# EAGLE design cBlocks proto shield (EAGLE 9.1.3)
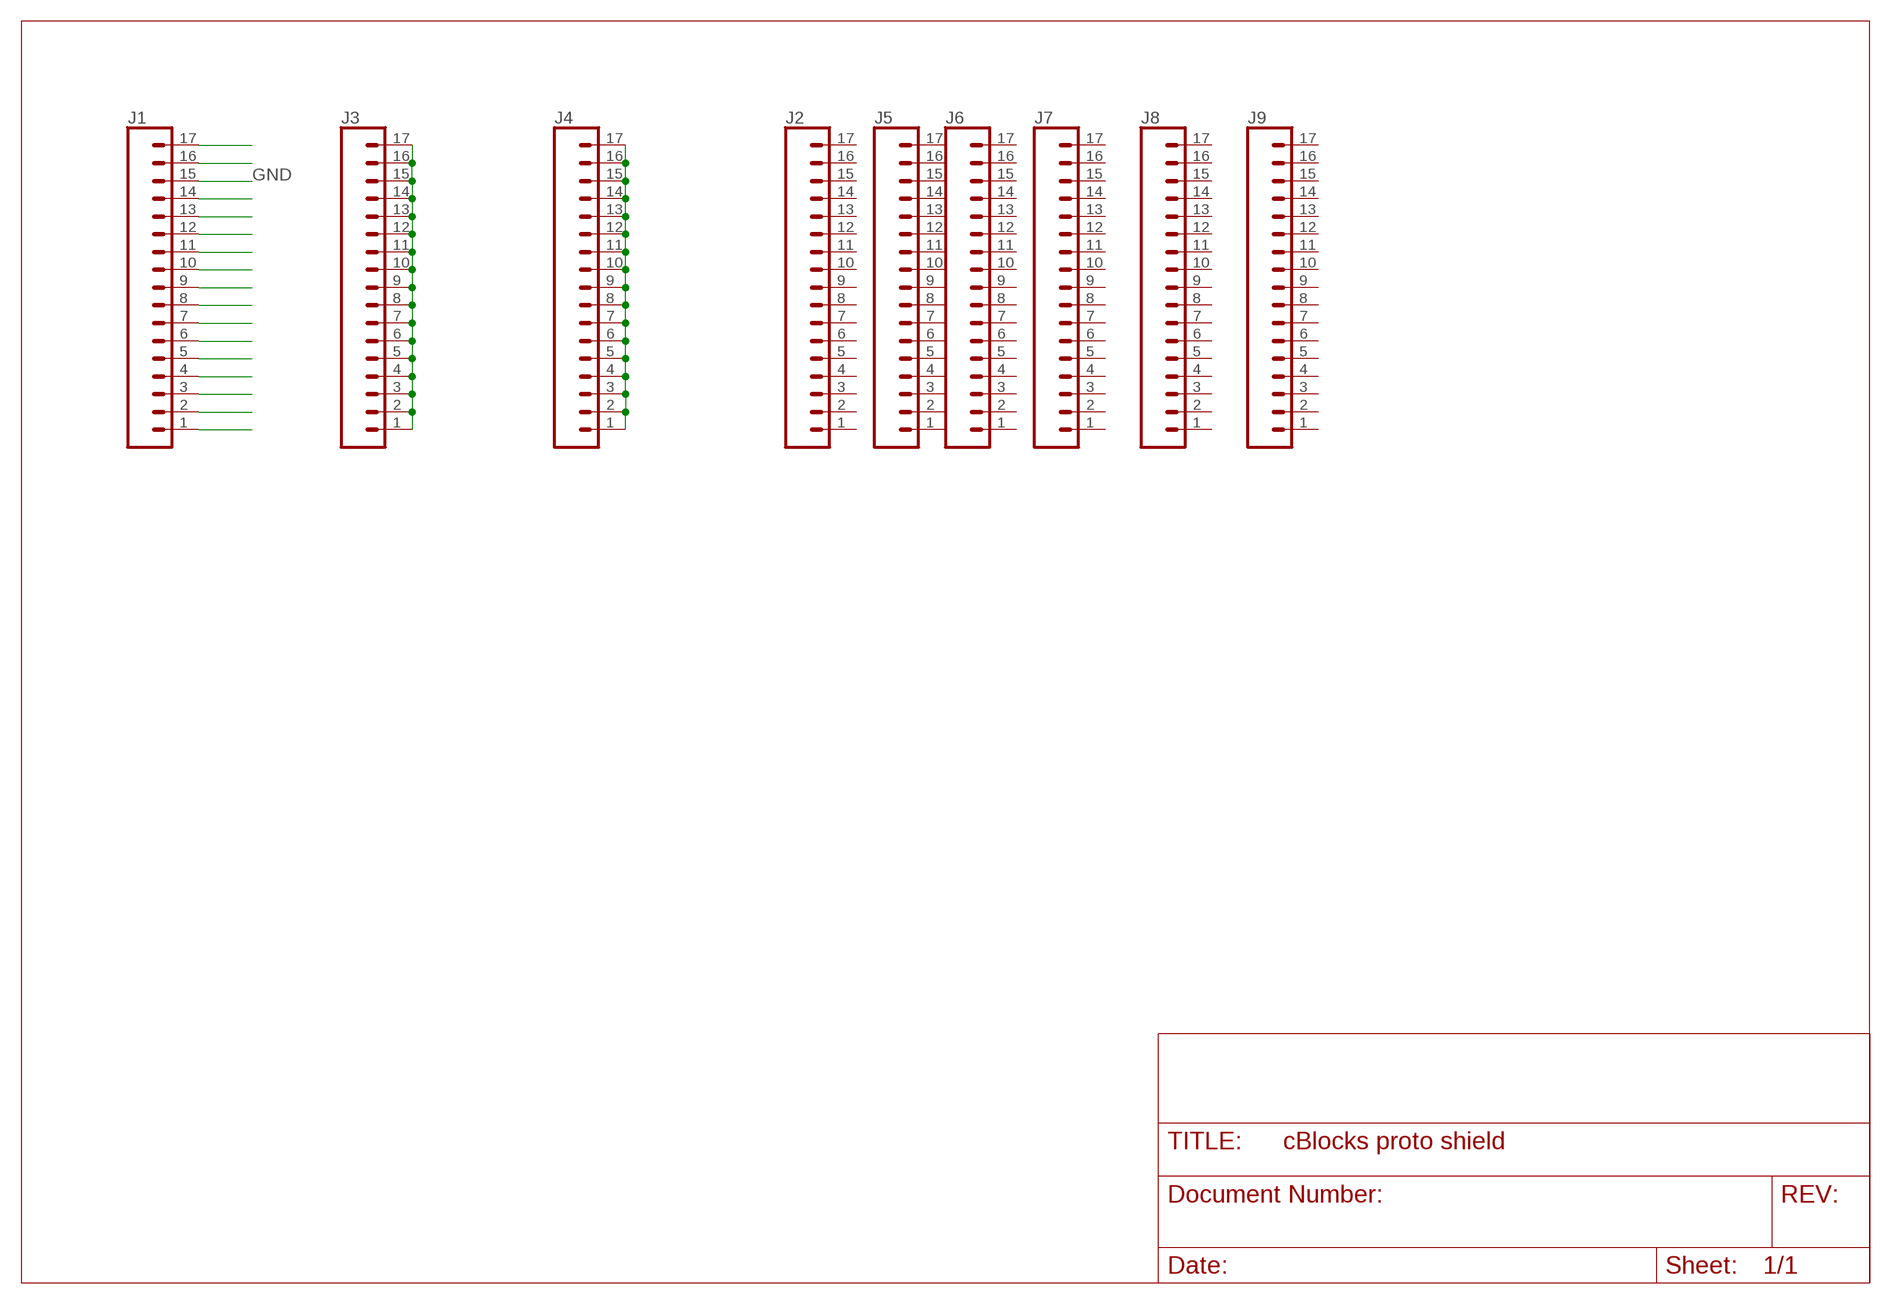
[diagram p0: schematic, sheet 1]

## Parts
J1  CONN_17NOSILK  [1X17_NO_SILK]
J2  CONN_17NOSILK  [1X17_NO_SILK]
J3  CONN_17NOSILK  [1X17_NO_SILK]
J4  CONN_17NOSILK  [1X17_NO_SILK]
J5  CONN_17NOSILK  [1X17_NO_SILK]
J6  CONN_17NOSILK  [1X17_NO_SILK]
J7  CONN_17NOSILK  [1X17_NO_SILK]
J8  CONN_17NOSILK  [1X17_NO_SILK]
J9  CONN_17NOSILK  [1X17_NO_SILK]

## Nets
GND: J1.15
N$1: J3.1 J3.2 J3.3 J3.4 J3.5 J3.6 J3.7 J3.8 J3.9 J3.10 J3.11 J3.12 J3.13 J3.14 J3.15 J3.16 J3.17
N$2: J1.2
N$3: J1.3
N$4: J1.4
N$5: J1.5
N$6: J1.6
N$7: J1.7
N$8: J1.8
N$9: J1.9
N$10: J1.10
N$11: J1.11
N$12: J1.12
N$13: J1.13
N$14: J1.14
N$16: J1.16
N$17: J1.17
N$18: J4.1 J4.2 J4.3 J4.4 J4.5 J4.6 J4.7 J4.8 J4.9 J4.10 J4.11 J4.12 J4.13 J4.14 J4.15 J4.16 J4.17
TEST: J1.1
Unconnected: J2.1 J2.2 J2.3 J2.4 J2.5 J2.6 J2.7 J2.8 J2.9 J2.10 J2.11 J2.12 J2.13 J2.14 J2.15 J2.16 J2.17 J5.1 J5.2 J5.3 J5.4 J5.5 J5.6 J5.7 J5.8 J5.9 J5.10 J5.11 J5.12 J5.13 J5.14 J5.15 J5.16 J5.17 J6.1 J6.2 J6.3 J6.4 J6.5 J6.6 J6.7 J6.8 J6.9 J6.10 J6.11 J6.12 J6.13 J6.14 J6.15 J6.16 J6.17 J7.1 J7.2 J7.3 J7.4 J7.5 J7.6 J7.7 J7.8 J7.9 J7.10 J7.11 J7.12 J7.13 J7.14 J7.15 J7.16 J7.17 J8.1 J8.2 J8.3 J8.4 J8.5 J8.6 J8.7 J8.8 J8.9 J8.10 J8.11 J8.12 J8.13 J8.14 J8.15 J8.16 J8.17 J9.1 J9.2 J9.3 J9.4 J9.5 J9.6 J9.7 J9.8 J9.9 J9.10 J9.11 J9.12 J9.13 J9.14 J9.15 J9.16 J9.17

## Library data of the parts
J1-J9 = SparkFun-Connectors:CONN_17: Multi connection point. Often used as Generic Header-pin footprint for 0.1 inch spaced/style header connections On any of the 0.1 inch spaced packages, you can populate with these: Break Away Headers - Straight <https://www.sparkfun.com/products/116> (PRT-00116) Break Away Male Headers - Right Angle <https://www.sparkfun.com/products/553> (PRT-00553) Female Headers <https://www.sparkfun.com/products/115> (PRT-00115) Break Away Headers - Machine Pin <https://www.sparkfun.com/products/117> (PRT-00117) Break Away Female Headers - Swiss Machine Pin <https://www.sparkfun.com/products/743> (PRT-00743) For SCREWTERMINALS and SPRING TERMINALS visit here: Screw Terimnals on SparkFun.com <https://www.sparkfun.com/search/results?term=Screw+Terminals> (5mm/3.5mm/2.54mm spacing) This device is also useful as a general connection point to wire up your design to another part of your project. Our various solder wires solder well into these plated through hole pads. Hook-Up Wire - Assortment (Stranded, 22 AWG) <https://www.sparkfun.com/products/11375> (PRT-11375) Hook-Up Wire - Assortment (Solid Core, 22 AWG) <https://www.sparkfun.com/products/11367> (PRT-11367) View the entire wire category on our website here <https://www.sparkfun.com/categories/141> Special notes: Molex polarized connector foot print use with SKU : PRT-08231 with associated crimp pins and housings. 1MM SMD Version SKU: PRT-10208 NOTES ON THE VARIANTS LOCK and LOCK_LONGPADS... This footprint was designed to help hold the alignment of a through-hole component (i.e. 6-pin header) while soldering it into place. You may notice that each hole has been shifted either up or down by 0.005 of an inch from it's more standard position (which is a perfectly straight line). This slight alteration caused the pins (the squares in the middle) to touch the edges of the holes. Because they are alternating, it causes a "brace" to hold the component in place. 0.005 has proven to be the perfect amount of "off-center" position when using our standard breakaway headers. Although looks a little odd when you look at the bare footprint, once you have a header in there, the alteration is very hard to notice. Also,if you push a header all the way into place, it is covered up entirely on the bottom side.

## Board
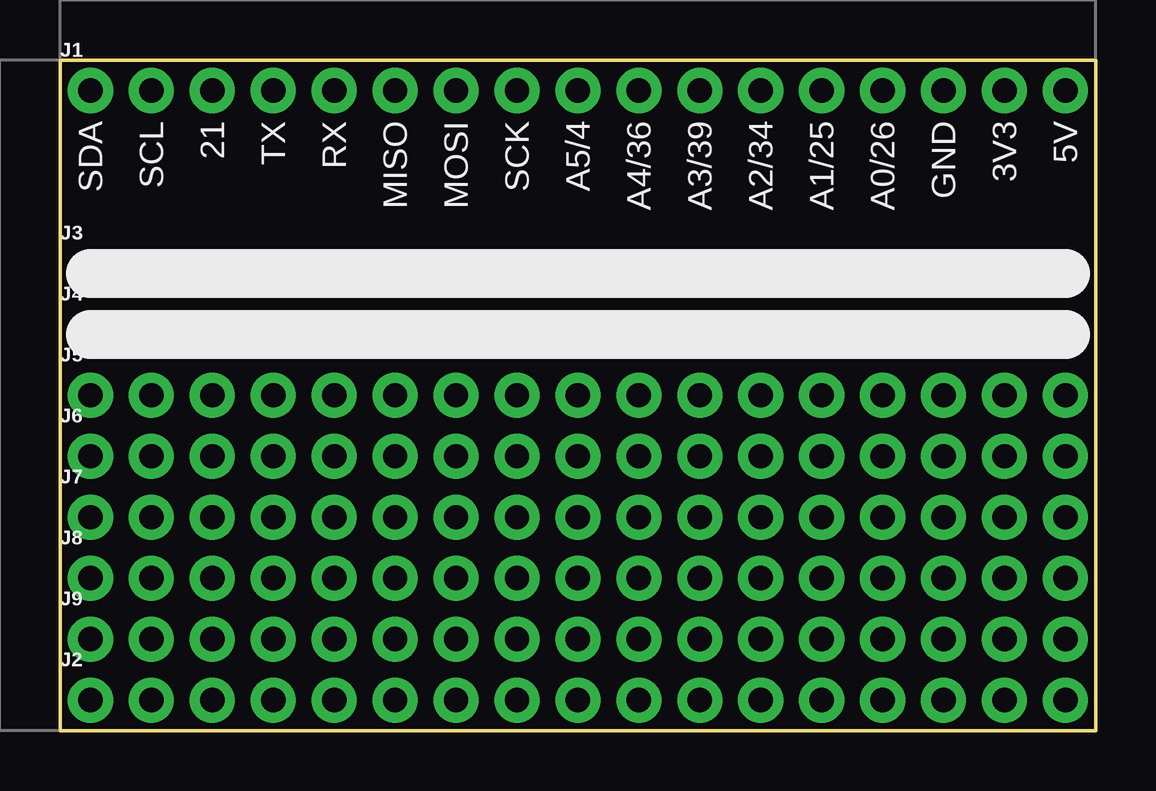
[diagram p1: board, top side]
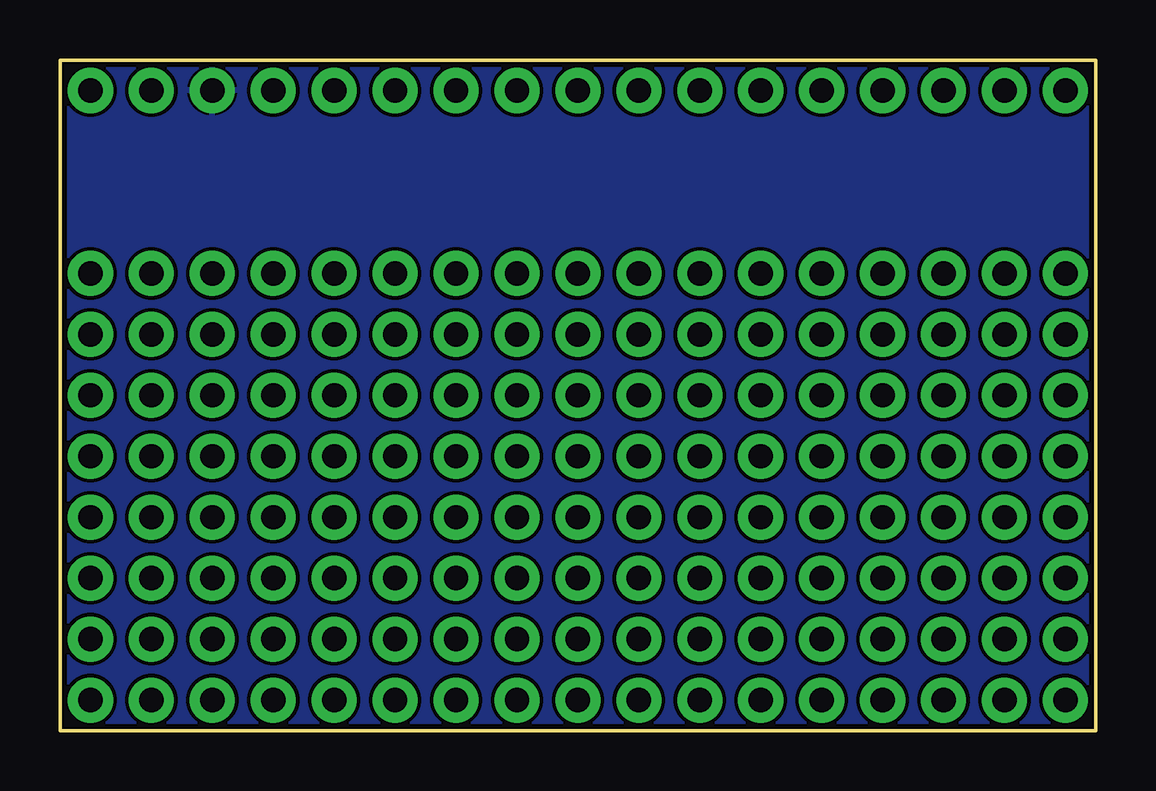
[diagram p2: board, bottom side, seen from below]

Size 43.18 x 27.94 mm. Coordinates in mm from the lower left corner, seen from the top.
Outline: 0,27.94 43.18,27.94 43.18,0 0,0 0,27.94
Copper layers (1*16): Top 0.018mm / dielectric 1.55mm / Bottom 0.018mm
Design rules "Fischer_zweilagig": minimum track width 0.15mm, minimum drill 0.3mm, track to track 0.15mm, track to pad 0.15mm, pad to pad 0.15mm, via to via 0.15mm, smd to smd 0mil, copper to edge 0.2mm, drill to drill 0.2mm, minimum pad ring 0.15mm, minimum via ring 0.15mm, stop-mask expansion 2mil, vias tented up to drill 0.45mm, thermal gap 0.1mm

### Footprints (pad centres in the part's own frame; a part is rotated, then mirrored left to right if it is on the bottom)
1X17_NO_SILK = drill 1.016 pad 1.88: 1 0,0; 2 2.54,0; 3 5.08,0; 4 7.62,0; 5 10.16,0; 6 12.7,0; 7 15.24,0; 8 17.78,0; 9 20.32,0; 10 22.86,0; 11 25.4,0; 12 27.94,0; 13 30.48,0; 14 33.02,0; 15 35.56,0; 16 38.1,0; 17 40.64,0

### Placement (x,y rotation side)
J1  1.27,26.67 0 top
J2  1.27,1.27 0 top
J3  1.27,19.05 0 top
J4  1.27,16.51 0 top
J5  1.27,13.97 0 top
J6  1.27,11.43 0 top
J7  1.27,8.89 0 top
J8  1.27,6.35 0 top
J9  1.27,3.81 0 top

### Tracks (layer width: path | path; a pad name or v marks a point on that pad's centre or on a via)
GND
  pour Bottom: 0,27.94 0,0 43.18,0 43.18,27.94
N$1
  Top 0.15: J3.17 41.85,19.04 39.45,19.04 J3.16 39.3,19.04 36.9,19.04 J3.15 36.75,19.04 34.35,19.04 J3.14 34.2,19.04 31.8,19.04 J3.13 31.65,19.04 29.25,19.04 J3.12 29.1,19.04 26.7,19.04 J3.11 26.55,19.04 24.15,19.04 J3.10 24,19.04 J3.9 21.45,19.04 J3.8 | J3.1 1.35,19.04 3.75,19.04 J3.2 3.9,19.04 6.3,19.04 J3.3 6.45,19.04 8.85,19.04 J3.4 9,19.04 11.4,19.04 J3.5 11.55,19.04 13.95,19.04 J3.6 14.1,19.04 J3.7 16.65,19.04 J3.8 | J3.8
N$18
  Top 0.15: J4.17 41.85,16.49 39.45,16.49 J4.16 39.3,16.49 36.9,16.49 J4.15 36.75,16.49 34.35,16.49 J4.14 34.2,16.49 31.8,16.49 J4.13 31.65,16.49 29.25,16.49 J4.12 29.1,16.49 26.7,16.49 J4.11 26.55,16.49 24.15,16.49 J4.10 24,16.49 21.6,16.49 J4.9 21.45,16.49 19.05,16.49 | J4.1 1.35,16.49 3.75,16.49 J4.2 3.9,16.49 6.3,16.49 J4.3 6.45,16.49 8.85,16.49 J4.4 9,16.49 11.4,16.49 J4.5 11.55,16.49 13.95,16.49 J4.6 14.1,16.49 16.5,16.49 J4.7 16.65,16.49 19.05,16.49 | 19.05,16.49 J4.8

### Text on the board
tPlace: SDA | SCL | 21 | TX | RX | MISO | MOSI | SCK | A5/4 | A4/36 | A3/39 | A2/34 | A1/25 | A0/26 | GND | 3V3 | 5V
bStop: CB - EFS - 1902 - 2V0